# Altium schematic sheet SCH-Button_LED_Sheet_1_Altium.schdoc
size 186 x 145 mm
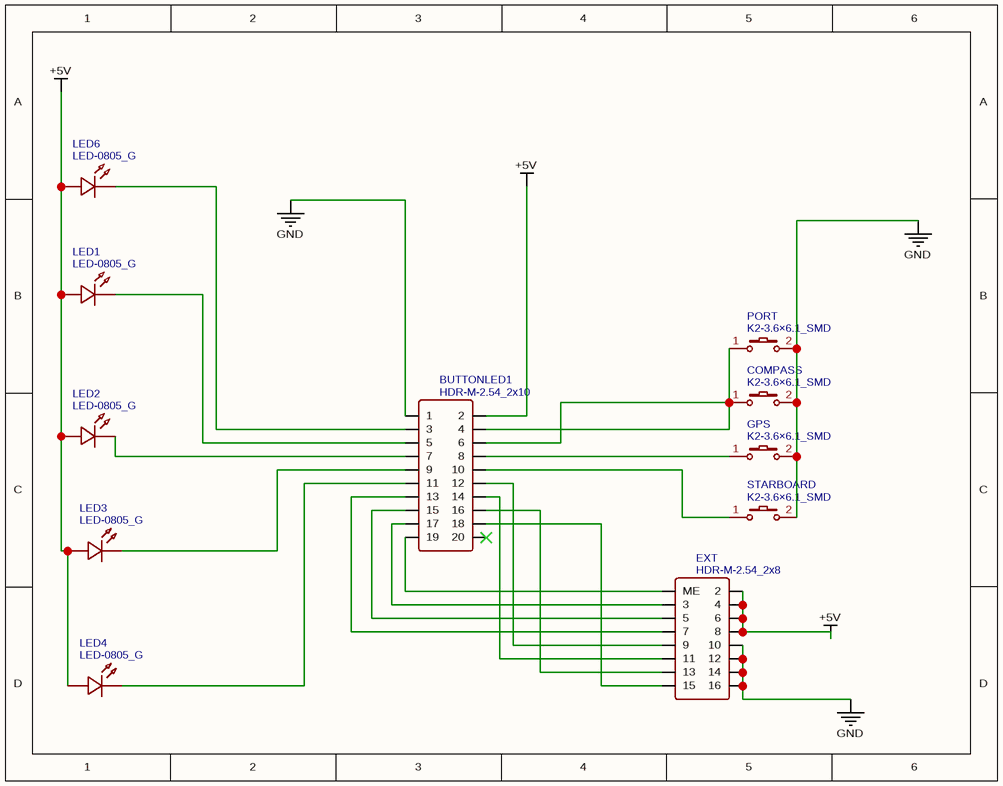
[diagram p0: SCH-Button_LED_Sheet_1_Altium.schdoc]

## Parts
BUTTONLED1  HDR-M-2.54_2x10  [HDR-M-2.54_2X10]
COMPASS  K2-3.6×6.1_SMD  [KEY-SMD_2P-L6.2-W3.6-LS8.0]
EXT  HDR-M-2.54_2x8  [HDR-M-2.54_2X8]
GPS  K2-3.6×6.1_SMD  [KEY-SMD_2P-L6.2-W3.6-LS8.0]
LED1  LED-0805_G  [LED0805_GREEN]
LED2  LED-0805_G  [LED0805_GREEN]
LED3  LED-0805_G  [LED0805_GREEN]
LED4  LED-0805_G  [LED0805_GREEN]
LED6  LED-0805_G  [LED0805_GREEN]
PORT  K2-3.6×6.1_SMD  [KEY-SMD_2P-L6.2-W3.6-LS8.0]
STARBOARD  K2-3.6×6.1_SMD  [KEY-SMD_2P-L6.2-W3.6-LS8.0]

## Nets
+5V: BUTTONLED1.2 EXT.2 EXT.4 EXT.6 EXT.8 LED1.1 LED2.1 LED3.1 LED4.1 LED6.1
GND: BUTTONLED1.1 COMPASS.2 EXT.10 EXT.12 EXT.14 EXT.16 GPS.2 PORT.2 STARBOARD.2
NetBUTTONLED1_3: BUTTONLED1.3 LED6.2
NetBUTTONLED1_4: BUTTONLED1.4 BUTTONLED1.6 COMPASS.1 PORT.1
NetBUTTONLED1_5: BUTTONLED1.5 LED1.2
NetBUTTONLED1_7: BUTTONLED1.7 LED2.2
NetBUTTONLED1_8: BUTTONLED1.8 GPS.1
NetBUTTONLED1_9: BUTTONLED1.9 LED3.2
NetBUTTONLED1_10: BUTTONLED1.10 STARBOARD.1
NetBUTTONLED1_11: BUTTONLED1.11 LED4.2
NetBUTTONLED1_12: BUTTONLED1.12 EXT.9
NetBUTTONLED1_13: BUTTONLED1.13 EXT.7
NetBUTTONLED1_14: BUTTONLED1.14 EXT.11
NetBUTTONLED1_15: BUTTONLED1.15 EXT.5
NetBUTTONLED1_16: BUTTONLED1.16 EXT.13
NetBUTTONLED1_17: BUTTONLED1.17 EXT.3
NetBUTTONLED1_18: BUTTONLED1.18 EXT.15
NetBUTTONLED1_19: BUTTONLED1.19 EXT.1(ME)

Not connected (* = marked no-connect by the designer): BUTTONLED1 20*

## Library data of the parts
BUTTONLED1 = HDR-M-2.54_2x10: Contributor: LCEDA_Lib; Supplier Part: C124359; Supplier: LCSC; spicePre: J; spiceSymbolName: HDR-M-2.54_2x10
COMPASS GPS PORT STARBOARD = K2-3.6×6.1_SMD: Manufacturer Part: K2-1107ST-A4SW-06; Contributor: LCEDA_Lib; 制造商: 韩国韩荣; Supplier Part: C118141; Supplier: LCSC; spicePre: K; spiceSymbolName: K2-3.6×6.1_SMD
EXT = HDR-M-2.54_2x8: Contributor: LCEDA_Lib; Supplier Part: C68234; Supplier: LCSC; spicePre: J; spiceSymbolName: HDR-M-2.54_2x8
LED1-LED4 LED6 = LED-0805_G: Manufacturer: 国星光电; Manufacturer Part: NCD0805G1; Contributor: LCEDA_Lib; Supplier Part: C84260; spicePre: L; spiceSymbolName: LED-0805_G